# Altium schematic sheet ESS.SchDoc: Energy Storage System (ESS)
size A; Author: Daniel Sherman; Revision: 1.0; SheetNumber: 6; SheetTotal: 10
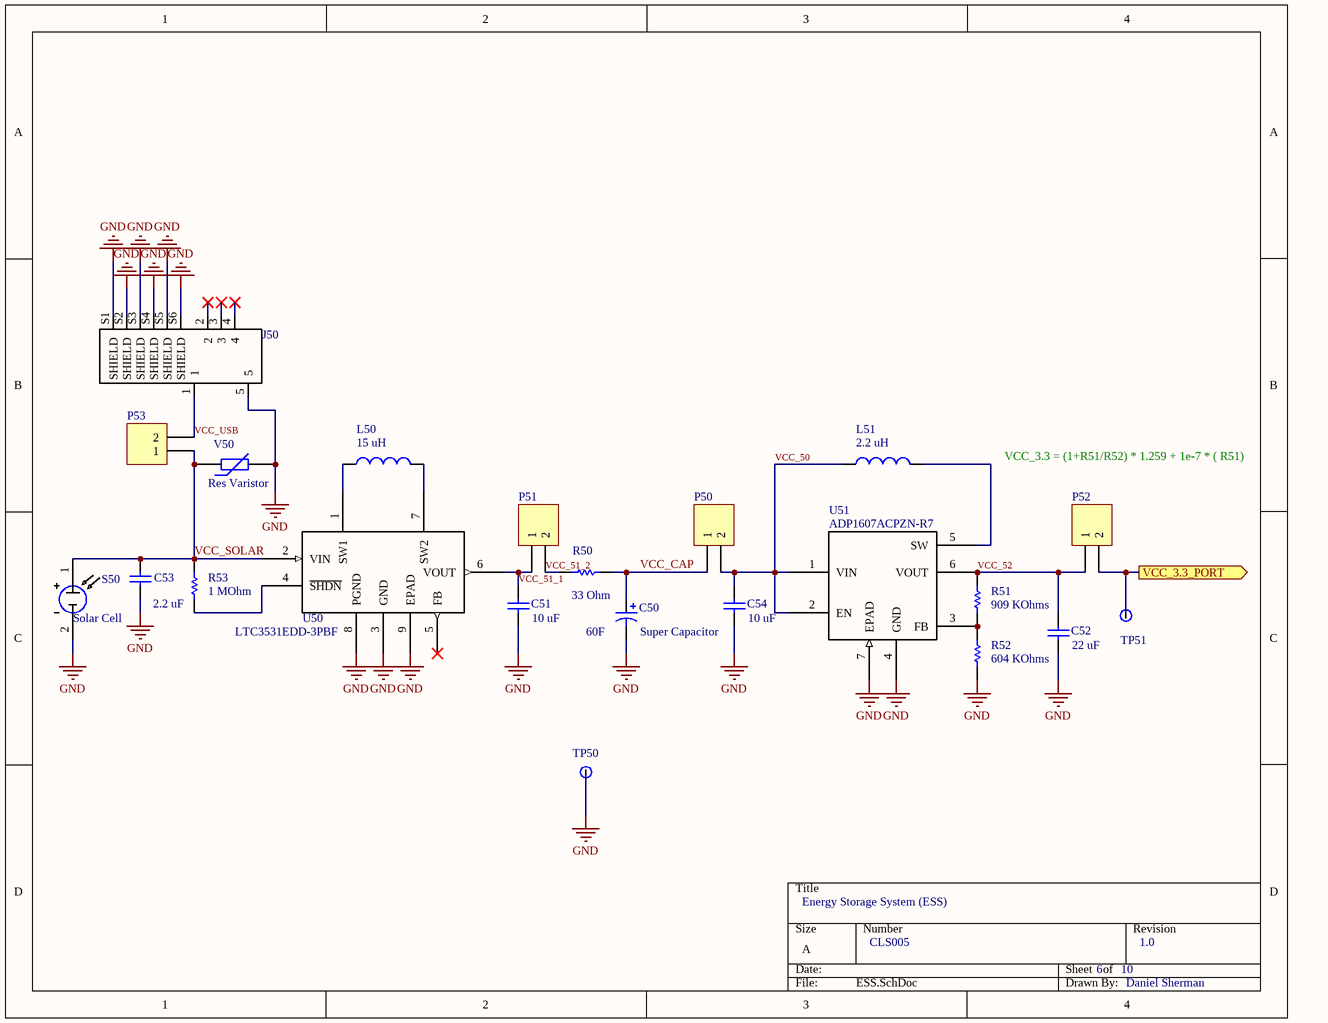
[diagram p0: ESS.SchDoc]

## Parts
C50  Super Capacitor  value 60F  [TV1840-3R0606-R]
C51  value 10 uF  [0805_CHIP_FP]  (hidden comment: Capacitor_unpolarized_0805)
C52  value 22 uF  [0805_CHIP_FP]  (hidden comment: Capacitor_unpolarized_0805)
C53  value 2.2 uF  [0805_CHIP_FP]  (hidden comment: Capacitor_unpolarized_0805)
C54  value 10 uF  [0805_CHIP_FP]  (hidden comment: Capacitor_unpolarized_0805)
J50  2174507-2  [J_SMD_2174507-2-5_7.8_5_2.71_2174507-2(Primary)]  (value not drawn)
L50  value 15 uH  [1919]  (hidden comment: Inductor_0805)
L51  value 2.2 uH  [0805_CHIP_FP]  (hidden comment: Inductor_0805)
P50  Header 2H  [HDR1X2]  (value not drawn)
P51  Header 2H  [HDR1X2]  (value not drawn)
P52  Header 2H  [HDR1X2]  (value not drawn)
P53  Header 2H  [HDR1X2]  (value not drawn)
R50  value 33 Ohm  [0805_CHIP_FP]  (hidden comment: Resistor_0805)
R51  value 909 KOhms  [0805_CHIP_FP]  (hidden comment: Resistor_0805)
R52  value 604 KOhms  [0805_CHIP_FP]  (hidden comment: Resistor_0805)
R53  value 1 MOhm  [0805_CHIP_FP]  (hidden comment: Resistor_0805)
S50  Solar Cell  [HDR1X2]
TP50  Testpoint  [HDR1X1]  (value not drawn)
TP51  Testpoint  [HDR1X1]  (value not drawn)
U50  LTC3531EDD-3PBF  [DFN-8_DD]
U51  ADP1607ACPZN-R7  [ADP1607]
V50  Res Varistor  [6-0805_N]

## Ports
VCC_3.3_PORT (out)

## Nets
GND: C50.2 C51.1 C52.1 C53.1 C54.1 J50.5 J50.S1(SHIELD) J50.S2(SHIELD) J50.S3(SHIELD) J50.S4(SHIELD) J50.S5(SHIELD) J50.S6(SHIELD) R52.1 S50.2 TP50.1(OUT) U50.3(GND) U50.8(PGND) U50.9(EPAD) U51.4(GND) U51.7(EPAD) V50.2
VCC_3.3_PORT: P52.2 TP51.1(OUT) ; port VCC_3.3_PORT
VCC_50: C54.2 L51.1 P50.2 U51.1(VIN) U51.2(EN)
VCC_51_1: C51.2 P51.1 U50.6(VOUT)
VCC_51_2: P51.2 R50.1
VCC_52: C52.2 P52.1 R51.2 U51.6(VOUT)
VCC_CAP: C50.1 P50.1 R50.2
VCC_SOLAR: C53.2 P53.1 R53.2 S50.1 U50.2(VIN) V50.1
VCC_USB: J50.1 P53.2
NetL50_1: L50.1 U50.1(SW1)
NetL50_2: L50.2 U50.7(SW2)
NetL51_2: L51.2 U51.5(SW)
NetR51_1: R51.1 R52.2 U51.3(FB)
NetR53_1: R53.1 U50.4(~{SHDN})

Not connected (* = marked no-connect by the designer): J50 2* 3* 4*; U50 5(FB)*

## Notes on the sheet
- VCC_3.3 = (1+R51/R52) * 1.259 + 1e-7 * ( R51)
- CLS005
- Daniel Sherman

## Library data of the parts
C50 = Capacitor Polarized: Manufacturer: Eaton; Vendor: Digikey; Vendor Description: CAP, 3.0V, 60F; ComponentLink1Description: Datasheet; ComponentLink1URL: https://www.digikey.com/products/en?keywords=TV1840-3R0606-R; Cost: 19.46; Manufacturer Part Number: TV1840-3R0606-R; Vendor Part Number: TV1840-3R0606-R
C51 C54 = Capacitor_unpolarized_0805: Manufacturer: Samsung Electro-Mechanics; Manufacturer Part Number: CL21A106KQCLRNC; Vendor Part Number: 1276-2405-1-ND; Vendor: Digikey; Vendor Description: CAP CER 10UF 6.3V X5R 0805; ComponentLink1Description: Datasheet; ComponentLink1URL: https://www.digikey.com/products/en?keywords=1276-2405-1-ND
  C51: Cost: .08
  C54: Cost: .11
C52 = Capacitor_unpolarized_0805: Manufacturer: Samsung Electro-Mechanics; Manufacturer Part Number: CL21A226MQQNNNE; Vendor Part Number: 1276-1100-1-ND; Vendor: Digikey; Vendor Description: CAP CER 22UF 6.3V X5R 0805; ComponentLink1Description: Datasheet; ComponentLink1URL: http://www.samsungsem.com/kr/support/product-search/mlcc/__icsFiles/afieldfile/2018/06/20/CL21A226MQQNNNE.pdf; Cost: 0.22
C53 = Capacitor_unpolarized_0805: Manufacturer: Wurth Electronics Inc.; Manufacturer Part Number: 885012107001; Vendor Part Number: 732-7612-1-ND; Vendor: Digikey; Vendor Description: CAP CER 2.2UF 6.3V X5R 0805; ComponentLink1Description: Datasheet; ComponentLink1URL: https://www.digikey.com/products/en?keywords=732-7612-1-ND; Cost: .14
J50 = 2174507-2: Manufacturer: TE Connectivity AMP Connectors; Vendor Part Number: A118106CT-ND; Vendor: Digikey; Vendor Description: REC TYPE-B ASSY MICRO USB I/O; Value: *; ComponentLink1Description: Datasheet; ComponentLink1URL: https://www.digikey.com/product-detail/en/te-connectivity-amp-connectors/2174507-2/A118106CT-ND/4729913; Cost: 2.88; Manufacturer Part Number: 2174507-2
L50 = Inductor_0805: Manufacturer: Wurth Electronics Inc.; Manufacturer Part Number: 744042150; Vendor Part Number: 732-3655-1-ND; Vendor: Digikey; Vendor Description: FIXED IND 15UH 1.03A 220 MOHM; ComponentLink1Description: Datasheet; ComponentLink1URL: https://katalog.we-online.de/pbs/datasheet/744042150.pdf; Cost: 1.43
L51 = Inductor_0805: Manufacturer: Taiyo Yuden; Manufacturer Part Number: BRC2012T2R2MD; Vendor Part Number: 587-2905-1-ND; Vendor: Digikey; Vendor Description: FIXED IND 2.2UH 1A 143 MOHM SMD; ComponentLink1Description: Datasheet; ComponentLink1URL: https://www.digikey.com/products/en?keywords=587-2905-1-ND; Cost: .35
P50-P53 = Header 2H: Vendor Part Number: PRT-00116; Vendor: Sparkfun; Vendor Description: .100 mil pitch male header x2; ComponentLink1Description: Datasheet; ComponentLink1URL: https://www.sparkfun.com/products/116; Cost: bulk
R50 = Resistor_0805: Manufacturer: Panasonic Electronic Components; Manufacturer Part Number: ERJ-P06J330V; Vendor Part Number: P33ADCT-ND; Vendor: Digikey; Vendor Description: RES SMD 33 OHM 5% 1/2W 0805; ComponentLink1Description: Datasheet; ComponentLink1URL: https://www.digikey.com/products/en?keywords=P33ADCT-ND; Cost: .12
R51 = Resistor_0805: Manufacturer: Yageo; Manufacturer Part Number: RC0805FR-07909KL; Vendor Part Number: 311-909KCRCT-ND; Vendor: Digikey; Vendor Description: RES SMD 909K OHM 1% 1/8W 0805; ComponentLink1Description: Datasheet; ComponentLink1URL: https://www.digikey.com/products/en?keywords=311-909KCRCT-ND; Cost: .10
R52 = Resistor_0805: Manufacturer: Yageo; Manufacturer Part Number: RC0805FR-07604KL; Vendor Part Number: 311-604KCRCT-ND; Vendor: Digikey; Vendor Description: RES SMD 604K OHM 1% 1/8W 0805; ComponentLink1Description: Datasheet; ComponentLink1URL: https://www.digikey.com/products/en?keywords=311-604KCRCT-ND; Cost: .10
R53 = Resistor_0805: Manufacturer: Yageo; Manufacturer Part Number: RC0805FR-071ML; Vendor Part Number: 311-1.00MCRCT-ND; Vendor: Digikey; Vendor Description: RES SMD 1M OHM 1% 1/8W 0805; ComponentLink1Description: Datasheet; ComponentLink1URL: https://www.digikey.com/products/en?keywords=311-1.00MCRCT-ND; Cost: .05
S50 = Solar Cell: IXOLAR SLMD121H08L; Manufacturer: IXYS; Vendor Part Number: SLMD121H08L-ND; Vendor: Digikey; Vendor Description: MONO SOLAR CELL 86MM X 14MM; ComponentLink1Description: Datasheet; ComponentLink1URL: https://www.digikey.com/product-detail/en/ixys/SLMD121H08L/SLMD121H08L-ND/3463125; Cost: 10.23; Manufacturer Part Number: SLMD121H08L
TP50 TP51 = Testpoint: Vendor Part Number: PRT-00116; Vendor: Sparkfun; Vendor Description: Break Away Headers - Straight; ComponentLink1URL: https://www.sparkfun.com/products/116; ComponentLink1Description: Datasheet; Manufacturer: Sparkfun; Manufacturer Part Number: PRT-00116; Cost: bulk
U50 = LTC3531EDD-3PBF: LTC3531 - 200mA Buck-Boost Synchronous DC/DC Converters; Manufacturer: Linear Technology; Vender Part Number: LTC3531EDD-3#PBF-ND; Manufacturer Part Number: LTC3531EDD-3#PBF; Vender: Digikey; Vender Description: IC REG BUCK BST 3.02V 0.2A 8DFN; Cost: 4.00; SnapEDA_Link: https://www.snapeda.com/parts/LTC3531EDD-3%23PBF/Linear%20Technology/view-part/?ref=snap; ComponentLink1Description: Datasheet; ComponentLink1URL: https://www.analog.com/media/en/technical-documentation/data-sheets/3531fb.pdf
U51 = ADP1607ACPZN-R7: Manufacturer: Analog Devices Inc.; Vendor Part Number: ADP1607ACPZN-R7CT-ND; Vendor: Digikey; Vendor Description: IC REG BOOST ADJ 1A SYNC 6LFCSP; ComponentLink1Description: Datasheet; ComponentLink1URL: https://www.digikey.com/products/en?keywords=ADP1607ACPZN-R7CT-ND; Cost: 3.40; Manufacturer Part Number: ADP1607ACPZN-R7
V50 = Res Varistor: Varistor (Voltage-Sensitive Resistor); Manufacturer: Littelfuse Inc.; Manufacturer Part Number: V5.5MLA0805NH; Vendor Part Number: F3814CT-ND; Vendor: Digikey; Vendor Description: VARISTOR 8.2V 120A 0805; ComponentLink1Description: Datasheet; ComponentLink1URL: http://www.littelfuse.com/~/media/electronics/datasheets/varistors/littelfuse_varistor_mla_datasheet.pdf.pdf; Cost: 0.53